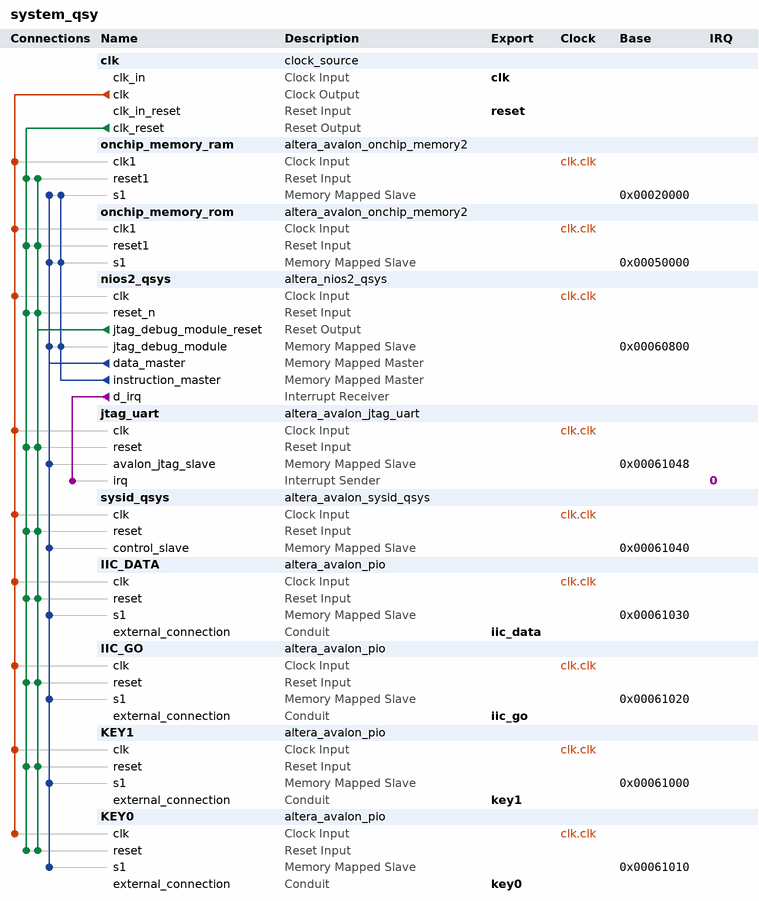
[diagram p0: system contents]
# Platform Designer (Qsys) system system_qsy, Cyclone IV E EP4CE115F29C7
# Parameters at their usual value, and those the tool derives, are not listed.
package require -exact qsys 13.1
create_system system_qsy
set_project_property DEVICE_FAMILY {Cyclone IV E}
set_project_property DEVICE EP4CE115F29C7

add_instance clk clock_source 13.1
set_instance_parameter_value clk clockFrequency 50000000

add_instance onchip_memory_ram altera_avalon_onchip_memory2 13.1
set_instance_parameter_value onchip_memory_ram dataWidth 32
set_instance_parameter_value onchip_memory_ram dualPort false
set_instance_parameter_value onchip_memory_ram initMemContent true
set_instance_parameter_value onchip_memory_ram initializationFileName onchip_mem.hex
set_instance_parameter_value onchip_memory_ram memorySize 81920

add_instance onchip_memory_rom altera_avalon_onchip_memory2 13.1
set_instance_parameter_value onchip_memory_rom dataWidth 32
set_instance_parameter_value onchip_memory_rom dualPort false
set_instance_parameter_value onchip_memory_rom initMemContent true
set_instance_parameter_value onchip_memory_rom initializationFileName onchip_mem.hex
set_instance_parameter_value onchip_memory_rom memorySize 40960
set_instance_parameter_value onchip_memory_rom writable false

add_instance nios2_qsys altera_nios2_qsys 13.1
set_instance_parameter_value nios2_qsys muldiv_divider true
set_instance_parameter_value nios2_qsys resetSlave onchip_memory_rom.s1
set_instance_parameter_value nios2_qsys mmu_TLBMissExcSlave None
set_instance_parameter_value nios2_qsys exceptionSlave onchip_memory_ram.s1
set_instance_parameter_value nios2_qsys breakSlave nios2_qsys.jtag_debug_module
set_instance_parameter_value nios2_qsys impl Fast
set_instance_parameter_value nios2_qsys icache_size 4096

add_instance jtag_uart altera_avalon_jtag_uart 13.1
set_instance_parameter_value jtag_uart simInteractiveOptions NO_INTERACTIVE_WINDOWS

add_instance sysid_qsys altera_avalon_sysid_qsys 13.1
set_instance_parameter_value sysid_qsys id 0

add_instance IIC_DATA altera_avalon_pio 13.1
set_instance_parameter_value IIC_DATA direction Output
set_instance_parameter_value IIC_DATA width 24

add_instance IIC_GO altera_avalon_pio 13.1
set_instance_parameter_value IIC_GO direction Output
set_instance_parameter_value IIC_GO width 1

add_instance KEY1 altera_avalon_pio 13.1
set_instance_parameter_value KEY1 direction Input
set_instance_parameter_value KEY1 width 1

add_instance KEY0 altera_avalon_pio 13.1
set_instance_parameter_value KEY0 direction Input
set_instance_parameter_value KEY0 width 1

# connections
add_connection clk.clk IIC_DATA.clk clock
add_connection clk.clk IIC_GO.clk clock
add_connection clk.clk jtag_uart.clk clock
add_connection clk.clk KEY0.clk clock
add_connection clk.clk KEY1.clk clock
add_connection clk.clk nios2_qsys.clk clock
add_connection clk.clk onchip_memory_ram.clk1 clock
add_connection clk.clk onchip_memory_rom.clk1 clock
add_connection clk.clk sysid_qsys.clk clock
add_connection clk.clk_reset IIC_DATA.reset reset
add_connection clk.clk_reset IIC_GO.reset reset
add_connection clk.clk_reset jtag_uart.reset reset
add_connection clk.clk_reset KEY0.reset reset
add_connection clk.clk_reset KEY1.reset reset
add_connection clk.clk_reset nios2_qsys.reset_n reset
add_connection clk.clk_reset onchip_memory_ram.reset1 reset
add_connection clk.clk_reset onchip_memory_rom.reset1 reset
add_connection clk.clk_reset sysid_qsys.reset reset
add_connection nios2_qsys.jtag_debug_module_reset IIC_DATA.reset reset
add_connection nios2_qsys.jtag_debug_module_reset IIC_GO.reset reset
add_connection nios2_qsys.jtag_debug_module_reset jtag_uart.reset reset
add_connection nios2_qsys.jtag_debug_module_reset KEY0.reset reset
add_connection nios2_qsys.jtag_debug_module_reset KEY1.reset reset
add_connection nios2_qsys.jtag_debug_module_reset nios2_qsys.reset_n reset
add_connection nios2_qsys.jtag_debug_module_reset onchip_memory_ram.reset1 reset
add_connection nios2_qsys.jtag_debug_module_reset onchip_memory_rom.reset1 reset
add_connection nios2_qsys.jtag_debug_module_reset sysid_qsys.reset reset
add_connection nios2_qsys.data_master IIC_DATA.s1 avalon
set_connection_parameter_value nios2_qsys.data_master/IIC_DATA.s1 baseAddress 0x00061030
add_connection nios2_qsys.data_master IIC_GO.s1 avalon
set_connection_parameter_value nios2_qsys.data_master/IIC_GO.s1 baseAddress 0x00061020
add_connection nios2_qsys.data_master jtag_uart.avalon_jtag_slave avalon
set_connection_parameter_value nios2_qsys.data_master/jtag_uart.avalon_jtag_slave baseAddress 0x00061048
add_connection nios2_qsys.data_master KEY0.s1 avalon
set_connection_parameter_value nios2_qsys.data_master/KEY0.s1 baseAddress 0x00061010
add_connection nios2_qsys.data_master KEY1.s1 avalon
set_connection_parameter_value nios2_qsys.data_master/KEY1.s1 baseAddress 0x00061000
add_connection nios2_qsys.data_master nios2_qsys.jtag_debug_module avalon
set_connection_parameter_value nios2_qsys.data_master/nios2_qsys.jtag_debug_module baseAddress 0x00060800
add_connection nios2_qsys.data_master onchip_memory_ram.s1 avalon
set_connection_parameter_value nios2_qsys.data_master/onchip_memory_ram.s1 baseAddress 0x00020000
add_connection nios2_qsys.data_master onchip_memory_rom.s1 avalon
set_connection_parameter_value nios2_qsys.data_master/onchip_memory_rom.s1 baseAddress 0x00050000
add_connection nios2_qsys.data_master sysid_qsys.control_slave avalon
set_connection_parameter_value nios2_qsys.data_master/sysid_qsys.control_slave baseAddress 0x00061040
add_connection nios2_qsys.instruction_master nios2_qsys.jtag_debug_module avalon
set_connection_parameter_value nios2_qsys.instruction_master/nios2_qsys.jtag_debug_module baseAddress 0x00060800
add_connection nios2_qsys.instruction_master onchip_memory_ram.s1 avalon
set_connection_parameter_value nios2_qsys.instruction_master/onchip_memory_ram.s1 baseAddress 0x00020000
add_connection nios2_qsys.instruction_master onchip_memory_rom.s1 avalon
set_connection_parameter_value nios2_qsys.instruction_master/onchip_memory_rom.s1 baseAddress 0x00050000
add_connection nios2_qsys.d_irq jtag_uart.irq interrupt
set_connection_parameter_value nios2_qsys.d_irq/jtag_uart.irq irqNumber 0

# exported interfaces
add_interface clk clock sink
set_interface_property clk EXPORT_OF clk.clk_in
add_interface reset reset sink
set_interface_property reset EXPORT_OF clk.clk_in_reset
add_interface iic_data conduit end
set_interface_property iic_data EXPORT_OF IIC_DATA.external_connection
add_interface iic_go conduit end
set_interface_property iic_go EXPORT_OF IIC_GO.external_connection
add_interface key1 conduit end
set_interface_property key1 EXPORT_OF KEY1.external_connection
add_interface key0 conduit end
set_interface_property key0 EXPORT_OF KEY0.external_connection

set_interconnect_requirement {$system} qsys_mm.clockCrossingAdapter HANDSHAKE
set_interconnect_requirement {$system} qsys_mm.maxAdditionalLatency 1
set_interconnect_requirement {$system} qsys_mm.insertDefaultSlave false

save_system system_qsy.qsys
